# EAGLE board homeboard29 (EAGLE 6.0)
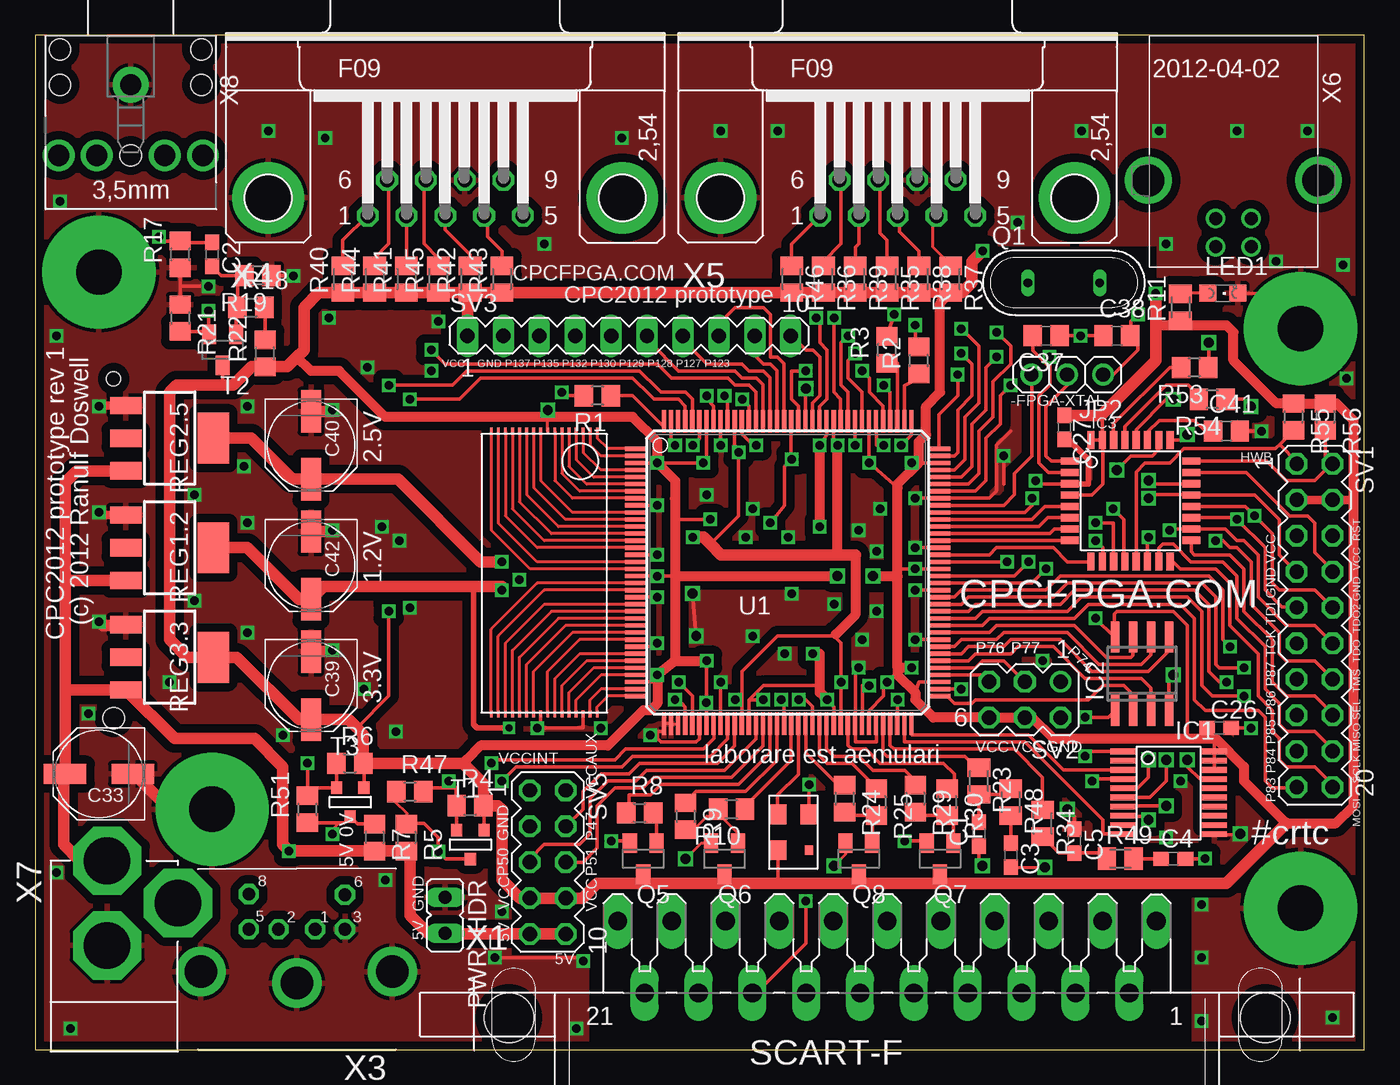
[diagram p3: board, top side]
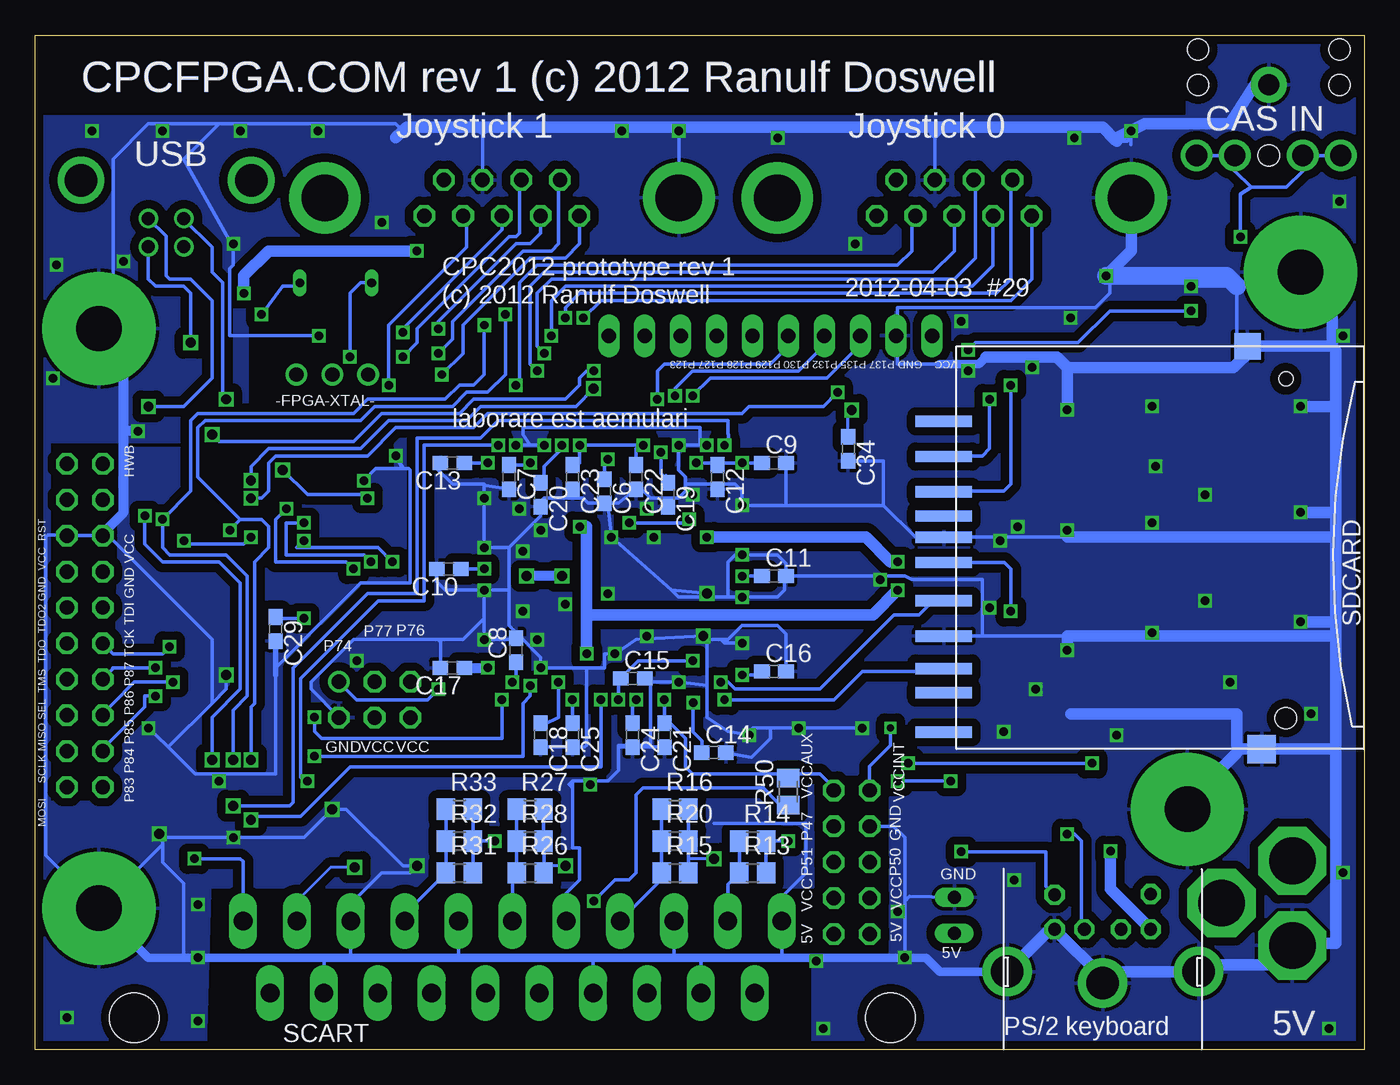
[diagram p4: board, bottom side, seen from below]

Size 94 x 71.75 mm. Coordinates in mm from the lower left corner, seen from the top.
Outline: 0,0 94,0 94,71.75 0,71.75 0,0
Copper layers (1*16): Top 0.0356mm / dielectric 1.5011mm / Bottom 0.0356mm
Design rules: minimum track width 7mil, minimum drill 15mil, track to track 7mil, track to pad 7mil, pad to pad 7mil, via to via 7mil, smd to smd 7mil, copper to edge 15mil, drill to drill 15mil, minimum pad ring 7mil, minimum via ring 7mil, stop-mask expansion 4mil, vias tented up to drill 0mil, thermal gap 10mil
Net classes: 1 power: width 0.6 mm, drill 1.1 mm, clearance 0.4 mm; 2 gnd: width 0.305 mm, drill 0.508 mm, clearance 0.152 mm

## Footprints (pad centres in the part's own frame; a part is rotated, then mirrored left to right if it is on the bottom)
C0603 = smd 1.1 x 1: 1 -0.85,0; 2 0.85,0
PANASONIC_D = smd 3 x 1.4: + 2.4,0; - -2.4,0
C0805 = smd 1.3 x 1.5: 1 -0.95,0; 2 0.95,0
VO20 = smd 0.4 x 1.8: 1 5.85,6.15; 2 5.2,6.15; 3 4.55,6.15; 4 3.9,6.15; 5 3.25,6.15; 6 2.6,6.15; 7 1.95,6.15; 8 1.3,6.15; 9 0.65,6.15; 10 0,6.15; 11 0,-0.3; 12 0.65,-0.3; 13 1.3,-0.3; 14 1.95,-0.3; 15 2.6,-0.3; 16 3.25,-0.3; 17 3.9,-0.3; 18 4.55,-0.3; 19 5.2,-0.3; 20 5.85,-0.3
SO-08 = smd 0.6 x 2.2: 1 -1.905,-2.6; 2 -0.635,-2.6; 3 0.635,-2.6; 4 1.905,-2.6; 5 1.905,2.6; 6 0.635,2.6; 7 -0.635,2.6; 8 -1.905,2.6
TQFP32-08 = smd 1.27 x 0.508: 1 -4.293,2.8; 2 -4.293,2; 3 -4.293,1.2; 4 -4.293,0.4; 5 -4.293,-0.4; 6 -4.293,-1.2; 7 -4.293,-2; 8 -4.293,-2.8; 17 4.293,-2.8; 18 4.293,-2; 19 4.293,-1.2; 20 4.293,-0.4; 21 4.293,0.4; 22 4.293,1.2; 23 4.293,2; 24 4.293,2.8 | smd 0.508 x 1.27: 9 -2.8,-4.293; 10 -2,-4.293; 11 -1.2,-4.293; 12 -0.4,-4.293; 13 0.4,-4.293; 14 1.2,-4.293; 15 2,-4.293; 16 2.8,-4.293; 25 2.8,4.293; 26 2,4.293; 27 1.2,4.293; 28 0.4,4.293; 29 -0.4,4.293; 30 -1.2,4.293; 31 -2,4.293; 32 -2.8,4.293
1X03 = drill 1.016: 1 -2.54,0; 2 0,0; 3 2.54,0
CHIPLED_0805 = smd 1.2 x 1.2: A 0,-1.05; C 0,1.05
JP1 = drill 0.914 long: 1 0,-1.27; 2 0,1.27
QS = drill 0.61 long: 1 -2.54,0; 2 2.54,0
SOT23 = smd 1 x 1.4: 1 -0.95,-1.1; 2 0.95,-1.1; 3 0,1.1
R0805 = smd 1.3 x 1.5: 1 -0.95,0; 2 0.95,0
M0805 = smd 1.3 x 1.6: 1 -0.95,0; 2 0.95,0
SOT223 = smd 1.219 x 2.235: 1 -2.311,-3.099; 2 0,-3.099; 3 2.311,-3.099 | smd 3.6 x 2.2: 4 0,3.099
MA10-2 = drill 1.016 octagon: 1 -11.43,-1.27; 2 -11.43,1.27; 3 -8.89,-1.27; 4 -8.89,1.27; 5 -6.35,-1.27; 6 -6.35,1.27; 7 -3.81,-1.27; 8 -3.81,1.27; 9 -1.27,-1.27; 10 -1.27,1.27; 11 1.27,-1.27; 12 1.27,1.27; 13 3.81,-1.27; 14 3.81,1.27; 15 6.35,-1.27; 16 6.35,1.27; 17 8.89,-1.27; 18 8.89,1.27; 19 11.43,-1.27; 20 11.43,1.27
MA03-2 = drill 1.016: 1 -2.54,-1.27 | drill 1.016 octagon: 2 -2.54,1.27; 3 0,-1.27; 4 0,1.27; 5 2.54,-1.27; 6 2.54,1.27
MA10-1 = drill 1.016 long: 1 -11.43,0; 2 -8.89,0; 3 -6.35,0; 4 -3.81,0; 5 -1.27,0; 6 1.27,0; 7 3.81,0; 8 6.35,0; 9 8.89,0; 10 11.43,0
MA05-2 = drill 1.016 octagon: 1 -5.08,-1.27; 2 -5.08,1.27; 3 -2.54,-1.27; 4 -2.54,1.27; 5 0,-1.27; 6 0,1.27; 7 2.54,-1.27; 8 2.54,1.27; 9 5.08,-1.27; 10 5.08,1.27
SOT-23 = smd 0.787 x 0.889: 1 0.025,-1.016; 2 -0.94,1.016; 3 0.991,1.016
TQ144 = smd 1.6 x 0.3: P1 -10.7,8.75; P2 -10.7,8.25; P3 -10.7,7.75; P4 -10.7,7.25; P5 -10.7,6.75; P6 -10.7,6.25; P7 -10.7,5.75; P8 -10.7,5.25; P9 -10.7,4.75; P10 -10.7,4.25; P11 -10.7,3.75; P12 -10.7,3.25; P13 -10.7,2.75; P14 -10.7,2.25; P15 -10.7,1.75; P16 -10.7,1.25; P17 -10.7,0.75; P18 -10.7,0.25; P19 -10.7,-0.25; P20 -10.7,-0.75; P21 -10.7,-1.25; P22 -10.7,-1.75; P23 -10.7,-2.25; P24 -10.7,-2.75; P25 -10.7,-3.25; P26 -10.7,-3.75; P27 -10.7,-4.25; P28 -10.7,-4.75; P29 -10.7,-5.25; P30 -10.7,-5.75; P31 -10.7,-6.25; P32 -10.7,-6.75; P33 -10.7,-7.25; P34 -10.7,-7.75; P35 -10.7,-8.25; P36 -10.7,-8.75; P73 10.7,-8.75; P74 10.7,-8.25; P75 10.7,-7.75; P76 10.7,-7.25; P77 10.7,-6.75; P78 10.7,-6.25; P79 10.7,-5.75; P80 10.7,-5.25; P81 10.7,-4.75; P82 10.7,-4.25; P83 10.7,-3.75; P84 10.7,-3.25; P85 10.7,-2.75; P86 10.7,-2.25; P87 10.7,-1.75; P88 10.7,-1.25; P89 10.7,-0.75; P90 10.7,-0.25; P91 10.7,0.25; P92 10.7,0.75; P93 10.7,1.25; P94 10.7,1.75; P95 10.7,2.25; P96 10.7,2.75; P97 10.7,3.25; P98 10.7,3.75; P99 10.7,4.25; P100 10.7,4.75; P101 10.7,5.25; P102 10.7,5.75; P103 10.7,6.25; P104 10.7,6.75; P105 10.7,7.25; P106 10.7,7.75; P107 10.7,8.25; P108 10.7,8.75 | smd 0.3 x 1.6: P37 -8.75,-10.7; P38 -8.25,-10.7; P39 -7.75,-10.7; P40 -7.25,-10.7; P41 -6.75,-10.7; P42 -6.25,-10.7; P43 -5.75,-10.7; P44 -5.25,-10.7; P45 -4.75,-10.7; P46 -4.25,-10.7; P47 -3.75,-10.7; P48 -3.25,-10.7; P49 -2.75,-10.7; P50 -2.25,-10.7; P51 -1.75,-10.7; P52 -1.25,-10.7; P53 -0.75,-10.7; P54 -0.25,-10.7; P55 0.25,-10.7; P56 0.75,-10.7; P57 1.25,-10.7; P58 1.75,-10.7; P59 2.25,-10.7; P60 2.75,-10.7; P61 3.25,-10.7; P62 3.75,-10.7; P63 4.25,-10.7; P64 4.75,-10.7; P65 5.25,-10.7; P66 5.75,-10.7; P67 6.25,-10.7; P68 6.75,-10.7; P69 7.25,-10.7; P70 7.75,-10.7; P71 8.25,-10.7; P72 8.75,-10.7; P109 8.75,10.7; P110 8.25,10.7; P111 7.75,10.7; P112 7.25,10.7; P113 6.75,10.7; P114 6.25,10.7; P115 5.75,10.7; P116 5.25,10.7; P117 4.75,10.7; P118 4.25,10.7; P119 3.75,10.7; P120 3.25,10.7; P121 2.75,10.7; P122 2.25,10.7; P123 1.75,10.7; P124 1.25,10.7; P125 0.75,10.7; P126 0.25,10.7; P127 -0.25,10.7; P128 -0.75,10.7; P129 -1.25,10.7; P130 -1.75,10.7; P131 -2.25,10.7; P132 -2.75,10.7; P133 -3.25,10.7; P134 -3.75,10.7; P135 -4.25,10.7; P136 -4.75,10.7; P137 -5.25,10.7; P138 -5.75,10.7; P139 -6.25,10.7; P140 -6.75,10.7; P141 -7.25,10.7; P142 -7.75,10.7; P143 -8.25,10.7; P144 -8.75,10.7
GNDHOLE = drill 3.2 pad 8: GND 0,0
OSC_7C = smd 0.7 x 0.6: ENA -1.27,-1.1 | smd 1.4 x 1.2: GND 1.27,-1.1; OUT 1.27,1.1; VDD -1.27,1.1
SDCARD-NOHOLE = smd 0.8 x 4 bottom: 1 7.8,0.99; 2 10.3,0.99; 3 13.5,0.99; 4 15.3,0.99; 5 18,0.99; 6 20.5,0.99; 7 22.8,0.99; 8 24.5,0.99; 9 5.3,0.99; CD 12,0.99; WP 27.3,0.99 | smd 2.032 x 2.032 bottom: MT1 28.5,-21.5 | smd 1.9 x 1.9 bottom: MT3 0,-20.5 | hole 1.5: 26.3,-23.21 | hole 1: 2.3,-23.21
TSOP32 = smd 0.5 x 0.2: P1 -9.75,3.75; P2 -9.75,3.25; P3 -9.75,2.75; P4 -9.75,2.25; P5 -9.75,1.75; P6 -9.75,1.25; P7 -9.75,0.75; P8 -9.75,0.25; P9 -9.75,-0.25; P10 -9.75,-0.75; P11 -9.75,-1.25; P12 -9.75,-1.75; P13 -9.75,-2.25; P14 -9.75,-2.75; P15 -9.75,-3.25; P16 -9.75,-3.75; P17 10.25,-3.75; P18 10.25,-3.25; P19 10.25,-2.75; P20 10.25,-2.25; P21 10.25,-1.75; P22 10.25,-1.25; P23 10.25,-0.75; P24 10.25,-0.25; P25 10.25,0.25; P26 10.25,0.75; P27 10.25,1.25; P28 10.25,1.75; P29 10.25,2.25; P30 10.25,2.75; P31 10.25,3.25; P32 10.25,3.75
SCART-CLIP = drill 1.321 long: 1 19.05,5.08; 2 17.145,0; 3 15.24,5.08; 4 13.335,0; 5 11.43,5.08; 6 9.525,0; 7 7.62,5.08; 8 5.715,0; 9 3.81,5.08; 10 1.905,0; 11 0,5.08; 12 -1.905,0; 13 -3.81,5.08; 14 -5.715,0; 15 -7.62,5.08; 16 -9.525,0; 17 -11.43,5.08; 18 -13.335,0; 19 -15.24,5.08; 20 -17.145,0; 21 -19.05,5.08 | hole 3.5: 26.75,-1.75; -26.75,-1.75
M_DIN6 = drill 0.9 pad 1.422 octagon: 1 -1.3,-3.75; 2 1.3,-3.75; 3 -3.4,-3.75; 5 3.4,-3.75; 6 -3.4,-6.2; 8 3.4,-6.25 | drill 2.3 pad 3.5: SH1 6.8,-0.75; SH2 0,0.05; SH3 -6.75,-0.75
F09HP = drill 1.016 octagon: 1 -5.486,-1.27; 2 -2.743,-1.27; 3 0,-1.27; 4 2.743,-1.27; 5 5.486,-1.27; 6 -4.115,1.27; 7 -1.372,1.27; 8 1.372,1.27; 9 4.115,1.27 | drill 3.302 pad 5.08: G1 -12.522,0; G2 12.522,0
85-32004-10X = drill 0.92 pad 1.27: 1 4.71,-1.25; 2 4.71,1.25; 3 2.71,1.25; 4 2.71,-1.25 | drill 2.3 pad 3: M1 0,6.02; M2 0,-6.02
DC-21MM = drill 3.302 pad 4.826 octagon: 1 -5.08,-3.353; 2 -0.076,-6.35; 3 -0.076,-0.356
20-0137 = drill 1.5 pad 2.54: 1 -5,0 | drill 1.5: 2 0,5.1; 3 0,2.4; 4 0,-2.4; 5 0,-5.1 | hole 1.5: -5,5; -5,-5; 0,0; -7.5,5; -7.5,-5

## Placement (x,y rotation side)
C1  100nF  [C0603]  66.75,15.25 90 top
C2  100nF  [C0603]  12.5,56.25 270 top
C3  100nF  [C0603]  69,13.75 270 top
C4  100nF  [C0603]  80.5,13.5 0 top
C5  100nF  [C0603]  73.5,14.75 270 top
C6  100nF  [C0603]  53.75,39.5 270 bottom
C7  100nF  [C0603]  60.5,40.5 270 bottom
C8  100nF  [C0603]  60,28.25 90 bottom
C9  100nF  [C0603]  41.75,41.5 0 bottom
C10  100nF  [C0603]  64.75,34 180 bottom
C11  100nF  [C0603]  41.75,33.5 0 bottom
C12  100nF  [C0603]  45.75,40.5 270 bottom
C13  100nF  [C0603]  64.5,41.5 180 bottom
C14  100nF  [C0603]  46,21 0 bottom
C15  100nF  [C0603]  51.75,26.25 0 bottom
C16  100nF  [C0603]  41.75,26.75 0 bottom
C17  100nF  [C0603]  64.5,27 180 bottom
C18  100nF  [C0603]  58.25,22.25 270 bottom
C19  100nF  [C0603]  49.25,39.25 270 bottom
C20  100nF  [C0603]  58.25,39.25 270 bottom
C21  100nF  [C0603]  49.5,22.25 270 bottom
C22  100nF  [C0603]  51.5,40.5 270 bottom
C23  100nF  [C0603]  56,40.5 270 bottom
C24  100nF  [C0603]  51.75,22.25 270 bottom
C25  100nF  [C0603]  56,22.25 270 bottom
C26  100nF  [C0603]  83.75,22.75 0 top
C27  100nF  [C0603]  72.8,44.01 270 top
C29  100nF  [C0603]  77,29.75 270 bottom
C33  100u  [PANASONIC_D]  4.5,19.5 180 top
C34  100nF  [C0603]  36.5,42.5 270 bottom
C37  20pF  [C0805]  71.5,50.5 180 top
C38  20pF  [C0805]  76.5,50.5 0 top
C39  100u  [PANASONIC_D]  19.5,25.75 270 top
C40  100u  [PANASONIC_D]  19.5,42.75 270 top
C41  1uF  [C0805]  84.25,43.75 0 top
C42  100u  [PANASONIC_D]  19.5,34.25 270 top
IC1  XCF02S  [VO20]  83.09,15.24 90 top
IC2  25LC080SN  [SO-08]  78.28,26.58 0 top
IC3  ATMEGA32U2-TQFP  [TQFP32-08]  77.47,38.82 0 top
JP2  [1X03]  73,47.75 180 top
LED1  20mA  [CHIPLED_0805]  84,53.5 270 top
PWR_HDR  [JP1]  29,9.5 180 top
Q1  [QS]  72.75,54.25 0 top
Q5  BC848SMD  [SOT23]  43,13.5 180 top
Q6  BC848SMD  [SOT23]  48.75,13.5 180 top
Q7  BC848SMD  [SOT23]  64,13.5 180 top
Q8  BC848SMD  [SOT23]  58.25,13.5 180 top
R1  100  [R0805]  39.76,46.25 180 top
R2  100  [R0805]  62.5,48.75 90 top
R3  100  [R0805]  60.25,49.5 90 top
R4  1000  [R0805]  30.75,17.25 0 top
R5  1000  [R0805]  26.25,15 270 top
R6  1000  [R0805]  22.25,20.25 0 top
R7  1000  [R0805]  24,15 270 top
R8  2200  [R0805]  42.75,16.75 0 top
R9  2200  [R0805]  46,16.5 270 top
R10  1000  [R0805]  49.25,17 180 top
R11  75  [M0805]  81,52.5 90 top
R13  680  [R0805]  43.25,12.5 0 bottom
R14  2200  [R0805]  43.25,14.75 0 bottom
R15  270  [R0805]  48.75,12.5 0 bottom
R16  680  [R0805]  48.75,17 0 bottom
R17  10000  [R0805]  10.25,56.25 90 top
R18  4700  [R0805]  15.25,52.5 0 top
R19  10000  [R0805]  15.75,54.75 180 top
R20  4700  [R0805]  48.75,14.75 0 bottom
R21  47000  [R0805]  10.25,51.75 270 top
R22  1000  [R0805]  16.25,49.25 90 top
R23  75  [M0805]  66.75,19 270 top
R24  2200  [R0805]  57.25,17.75 270 top
R25  1000  [R0805]  59.5,17.5 270 top
R26  270  [R0805]  59,12.5 0 bottom
R27  680  [R0805]  59,17 0 bottom
R28  4700  [R0805]  59,14.75 0 bottom
R29  2200  [R0805]  62.25,17.75 270 top
R30  1000  [R0805]  64.5,17.5 270 top
R31  270  [R0805]  64,12.5 0 bottom
R32  680  [R0805]  64,14.75 0 bottom
R33  4700  [R0805]  64,17 0 bottom
R34  75  [M0805]  71.25,16 270 top
R35  [M0805]  60.25,54.5 270 top
R36  [M0805]  55.75,54.5 270 top
R37  [M0805]  64.75,54.5 270 top
R38  [M0805]  62.5,54.5 270 top
R39  [M0805]  58,54.5 270 top
R40  [M0805]  21.75,54.5 90 top
R41  [M0805]  26.25,54.5 90 top
R42  [M0805]  30.75,54.5 90 top
R43  [M0805]  33,54.5 90 top
R44  [M0805]  24,54.5 90 top
R45  [M0805]  28.5,54.5 90 top
R46  [M0805]  53.5,54.5 270 top
R47  270  [R0805]  26.5,18.25 0 top
R48  2200  [M0805]  69,17.5 270 top
R49  2200  [M0805]  76.75,13.5 0 top
R50  2k2  [M0805]  40.75,18.25 90 bottom
R51  270  [R0805]  19.25,17 90 top
R53  22  [R0805]  82,48.25 180 top
R54  22  [R0805]  83.25,46 180 top
R55  4700  [R0805]  89,44.75 270 top
R56  4700  [R0805]  91.25,44.75 270 top
REG1.2  1.2V  [SOT223]  9.5,35.5 270 top
REG2.5  2.5V  [SOT223]  9.5,43.25 270 top
REG3.3  3.3V  [SOT223]  9.5,27.75 270 top
SV1  [MA10-2]  90.5,30 270 top
SV2  [MA03-2]  70,24.75 180 top
SV3  [MA10-1]  42,50.5 0 top
SV5  [MA05-2]  36.25,13.25 270 top
T1  BSS138  [SOT-23]  30.75,14.5 0 top
T2  BC848  [SOT23]  13.25,49.5 180 top
T3  BSS138  [SOT-23]  22.25,17.5 0 top
U1  XC3S400TQ144  [TQ144]  53.22,33.75 0 top
U$1  GNDHOLE  [GNDHOLE]  12.5,17 0 top
U$2  TXO_7C  [OSC_7C]  53.62,15.38 90 top
U$3  SDMMCNOHOLE  [SDCARD-NOHOLE]  28.75,49.75 270 top
U$6  AS6C4008  [TSOP32]  36,34 270 top
U$7  GNDHOLE  [GNDHOLE]  4.5,55 0 top
U$8  GNDHOLE  [GNDHOLE]  89.5,51 0 top
U$9  GNDHOLE  [GNDHOLE]  89.5,10 0 top
X1  SCART-CLIP  [SCART-CLIP]  60.25,4 0 top
X3  [M_DIN6]  18.5,4.75 180 top
X4  [F09HP]  29,60.25 0 top
X5  [F09HP]  61,60.25 0 top
X6  MINI-USB_4P-85-32004-10X  [85-32004-10X]  84.75,61.5 270 top
X7  DC21MMX  [DC-21MM]  5,7 180 top
X8  STEREOJACK  [20-0137]  6.75,63.25 270 top

## Tracks (layer width: path | path; a pad name or v marks a point on that pad's centre or on a via)
AT_CLKO  (via drill 0.7)
  Top 0.254: v78.75,40.25 79,40 81.74,40 IC3.22 | U1.P124 54.47,46.72 v54.5,46.75
  Bottom 0.254: v78.75,40.25 78.75,41.25 77.5,42.5 71,42.5 69,44.5 63.5,44.5 62.5,45.5 55.75,45.5 v54.5,46.75
AT_RESET
  Top 0.254: IC3.24 87.13,41.62 88.5,40.25 90.5,40.25 91.75,41.5 | 91.75,41.5 91.75,41.45 SV1.2 | R56.2 91.25,42 91.75,41.5
B0
  Top 0.254: U1.P63 57.47,21.53 57.75,21.25 58.75,21.25 59.75,20.25 64.25,20.25 65,19.5 65,18.7 R30.1
B1
  Top 0.254: U1.P60 55.97,21.28 56.5,20.75 58.25,20.75 59.25,19.75 61.5,19.75 62.25,19 R29.1
CASIN  (via drill 0.6)
  Top 0.254: R21.2 12.1,50.8 T2.2 12.3,50.8 12.5,51 12.25,51 v12.25,52.25 | U1.P131 50.97,46.53 50.5,47 49.5,47 49,47.5 45,47.5 44,48.5 29,48.5 v28,49.5
  Bottom 0.254: v12.25,52.25 18,52.25 20.25,50 27.5,50 v28,49.5
CLK16
  Top 0.254: U1.P56 53.97,19.47 52.5,18 52.5,16.67 U$2.OUT
CLK_5V  (via drill 0.6)
  Top 0.2: 26.3,16 26.3,16.7 25.5,17.5 25.5,18.2 R47.1
  Top 0.254: T1.1 29.02,13.48 v28.5,14 28.5,15 27.5,16 26.3,16 R5.1
  Bottom 0.254: v28.5,14 22.5,14 22.5,11.55 X3.6
CSYNC
  Top 0.254: U1.P52 51.97,20.97 49.75,18.75 44.25,18.75 43.5,18 42,18 42,16.95 R8.1
DATA_5V  (via drill 0.6)
  Top 0.2: v21,15.25 21,15.55 21.5,16.05
  Top 0.254: R7.1 22.81,15.95 T3.1 21.84,16.05 21.5,16.05 R51.1
  Bottom 0.254: v21,15.25 20.5,15.25 20,14.75 20,8.7 X3.1
EMER_BOOT
  Top 0.254: SV1.1 89.23,41.57 88.05,42.75 88.05,42.85 | 88.05,42.85 R55.2 | IC3.13 77.87,40.87 78.5,41.5 80.25,41.5 81.25,42.5 87.7,42.5 88.05,42.85
EXP_A
  Top 0.254: U1.P47 49.47,21.47 48.25,20.25 42.75,20.25 42,19.5 40,19.5 38.75,18.25 38.75,17 37.52,15.77 SV5.4
EXP_B
  Top 0.254: U1.P50 50.97,21.97 48.75,19.75 43.25,19.75 42.5,19 40.5,19 39.25,17.75 39.25,15.25 38.5,14.5 36,14.5 34.98,13.48 SV5.5
EXP_C
  Top 0.254: U1.P51 51.47,21.47 49.25,19.25 43.75,19.25 43,18.5 41,18.5 39.75,17.25 39.75,14.25 38.75,13.25 SV5.6
EXTCLK
  Top 0.254: U1.P100 68.5,38.5 69.25,39.25 69.25,40.75 70.5,42 70.5,47.75 JP2.3
FL_DI
  Top 0.254: U1.P79 65.5,28 66,28.5 68.5,28.5 69,29 72.5,29 74.75,26.75 78.75,26.75 80.19,28.18 IC2.5
FL_DO
  Top 0.254: IC2.2 77.64,25.11 77,25.75 75.5,25.75 74.5,24.75 66.5,24.75 66.25,24.5 65,24.5 64.5,25 U1.P73
FL_HOLD
  Top 0.254: U1.P82 67.5,29.5 68,30 73.5,30 75.75,27.75 77.5,27.75 77.64,27.89 IC2.7
FL_SCLK
  Top 0.254: U1.P80 65,28.5 65.5,29 68,29 68.5,29.5 73,29.5 75.25,27.25 78.25,27.25 78.92,27.91 IC2.6
FL_SEL  (via drill 0.6)
  Top 0.254: v74.25,23.5 75.89,23.5 IC2.1 | v61,24.75 61,23.08 U1.P70
  Bottom 0.254: v74.25,23.5 74.25,22.5 73.75,22 61,22 v61,24.75
FL_WP
  Top 0.254: U1.P78 66,27.5 66.5,28 69,28 69.5,28.5 72,28.5 74.25,26.25 78.25,26.25 78.92,25.59 IC2.3
FPGA_AUDIO_LEFT
  Top 0.254: U1.P68 59.97,21.03 60.25,20.75 65.75,20.75 66.55,19.95 R23.1
FPGA_AUDIO_RIGHT
  Top 0.254: U1.P69 60.47,21.53 60.75,21.25 69.25,21.25 71.25,19.25 R34.1
G0
  Top 0.254: U1.P59 55.47,20.78 56,20.25 57.75,20.25 59,19 R25.1
G1
  Top 0.254: U1.P57 54.5,23.02 54.5,21 56.75,18.75 R24.1
GND  (via drill 0.6, 0.7)
  Top 0.2: U1.P37 U1.P38 U1.P39 | IC1.11 85.24,15.24 v85.25,15.25 | LED1.C 87,53.5 U$8.GND
  Top 0.254: U1.P9 v44,38.5 | U1.P22 v44,32 | U1.P16 v44,35 | U1.P81 v62.25,29 | U1.P88 v62.25,32.5 | U1.P94 v62.25,35.5 | U1.P117 57.97,43.03 v58,42.75 | v60,42.75 59.5,42.75 59.5,44.5 59.47,44.47 U1.P114 | U$6.P30 38.75,22.75 35.75,22.75 | U$6.P24 35.75,22.75 | 35.75,22.75 v35.5,22.75 | 44,22.5 v43.5,22.25 | U1.P29 43.75,28.5 v44,28.75 | U1.P42 46.97,21.97 46.75,21.75 44.25,21.75 44,22 44,22.5 | U1.P67 59.5,23.05 59.5,21.75 58,21.75 58,23.08 | v58.25,27 58,27 58,23.08 | 58,23.08 U1.P64 | R17.1 10.25,55.25 | R21.1 10.25,54 | 10.25,54 10.25,55.25 | 10.25,55.25 10,55.5 | R19.1 v18.25,54.75 | v12.25,54 10.25,54 | v62.25,39 U1.P101 67.5,39 68,39.5 68,42.75 69,43.75 | C38.1 v73.95,50.5 C37.1 | v70.75,40.25 71,40 73.15,40 IC3.3 73.23,40.02 73.25,40 | U1.P37 44.47,23.03 44.5,23 44.5,22.5 44,22.5 | U1.P39 45.47,23.03 45.5,23 | 68.5,40 v68.5,42 | U1.P45 48.47,25.72 v48.5,26 | U1.P136 48.47,43.03 v48.5,42.75 | 7,19.5 C33.- | 46.97,44.47 U1.P139 46.97,43.22 v46.5,42.75 | U$2.GND 54.73,18.73 v54.75,18.75 | v46.75,29.25 v46.5,32.25 | C5.1 73.5,16.5 v73,17 | IC2.4 80.19,26.18 v80.5,26.5 | C26.2 v86,22.75 | C1.1 66.75,13.25 v67,13 | v86.75,43.75 85.25,43.75 | 85.25,43.75 85,44 | C41.2 85.25,43.75 | v32.5,6.5 38.5,6.5 v38.75,6.25
  Top 0.406: C27.2 73.09,43.16 74.5,41.75 74.5,40 73.25,40
  Top 0.6: 6,30 6.4,30 REG3.3.1
  Top 0.61: REG2.5.1 4.56,45.56 v4.5,45.5 | REG1.2.1 4.69,37.81 v4.5,38
  Top 0.8: C39.- 20.5,28.15 v21,28.25 | C42.- 21,36.65 v21,36.75 | C40.- 21,45.15 v21,45.25 | U$1.GND 9.5,17 7,19.5
  Top 0.813: 6,30 4.75,30 v4.5,30.25
  Bottom 0.2: 25.5,5.5 X3.SH3 | 22.25,8.5 X3.3 | 18.5,5.1 X3.SH2 | v85.25,15.25 85,15 | 85,13.25 85,13.5
  Bottom 0.254: v62.25,32.5 62.15,32.4 | 62.25,30.5 v62.25,29 60.1,29 C8.2 | 62.25,30.5 v62.25,32.5 | 47,42.75 v48.5,42.75 48.5,41 48,40.5 48,40.1 | 47,42.75 v46.5,42.75 | 56,39 55.25,39 54.9,38.65 C6.2 | v58,42.75 59,42.75 | 59,42.75 v60,42.75 | 34,38.5 34,41.65 C34.2 | 47,42.75 47,44 59.5,44 59.5,43.5 59,42.75 | 60.5,32.5 v62.25,32.5 | v44,32 45,32 45,34.5 44.5,35 v44,35 41.5,35 40.9,34.4 C11.2 32.5,33.5 32,33.25 27,33.25 27,29.25 | 60.5,35.5 v62.25,35.5 v62.25,39 62.25,40 | v35.5,22.75 42,22.75 | 42,22.75 43.25,22.75 v43.5,22.25 45,22.5 46.5,23.5 46.5,25.75 | U$3.6 27,29.25 | 27,29.25 21,29.25 | 21,36.25 U$3.3 31.75,36.25 34,38.5 | v44,28.75 45.25,28.75 45.5,29 | 56,19 56,14.25 55.5,14.25 55.5,12 56.5,11 56.44,10.94 X1.13 | v12.25,54 9,54 9,50.5 U$3.MT3 | 81,65.5 83.5,63 80,56.75 80,55.5 80.25,55.25 80.25,50.5 v73.95,50.5 | 81,65.5 68.5,65.5 68,65 | 85,14.5 85,15 75,15 v73,17 72,17 68,13 v67,13 67.5,12.5 69.5,12.5 71.68,10.32 X1.5 71.68,6.82 | 85,14.5 85,13.25 83.5,11.75 83.5,6.5 | 30,48.5 33,48.5 33,50.5 SV3.2 33,50.61 33,52.5 19,52.5 18,53.5 18,54.5 v18.25,54.75 | X5.G1 48.48,65.23 | X4.8 30.37,64.62 31,65.25 | X5.8 62.37,65.12 | 81,65.5 86,65.5 88.5,63 88.5,50.5 U$8.GND | 77,26.5 77,19.5 82.7,19.5 84.6,21.4 | SV2.2 72.54,23.54 74.5,25.5 74.5,26 71.5,29 65.5,29 | 65.5,29 63.75,29 62.25,30.5 | v70.75,40.25 69.91,41.09 68,41.09 | 68,41.09 67.59,41.09 67.5,41 67.5,33 71,33 77,27 | v68.5,42 68,41.09 | 52.4,21.4 C24.2 C21.2 52.65,21.4 52.75,21.5 | 55,27 55,21.5 55.15,21.4 C25.2 C18.2 | 52.75,21.5 52.75,19.75 53.5,19 54.75,19 | 52.75,21.5 50.5,21.5 50.5,26 | C16.2 40.9,29.4 41.5,30 44,30 45,29 45.5,29 | C10.2 65.6,33.1 65,32.5 v62.25,32.5
  Bottom 0.254: C17.2 65.35,28.85 65.5,29 | 62.25,40 64.5,40 65.6,41.1 65.6,41.4 65.5,41.5 C13.2 | C14.2 43.35,20.65 42,22 42,22.75 | 46.5,29 v46.75,29.25 51.5,29 v53,28 53.75,28 53.75,27 55,27 | 46.5,29 45.5,29 | C15.2 50.5,26 | 50.5,26 v48.5,26 46.5,25.75 | 46.5,25.75 46.5,29 | 41,33.5 41,32.5 41.5,32 48.5,32 49,32.5 | C9.2 40.9,38.6 41,38.5 | 41,38.5 v44,38.5 44,39.5 44.5,40 45.65,40 C12.2 46.1,40 47.9,40 48,40.1 | 34,38.5 41,38.5 | 55,27 v58.25,27 58.25,27.75 59.5,29 60,29 | C7.2 62.15,39.9 62.25,40 | C23.2 56,39 | 48,40.1 48,39.5 48.5,39 49.5,39 | 9,21 9,21.25 | 17.5,64.5 17.62,64.38 | SV5.3 33.29,15.79 32.5,15 32.5,10.5 | 32.5,10.5 v32.5,6.5 | PWR_HDR.1 32.18,10.82 32.5,10.5 | 84.6,21.4 81.5,24.5 | 81.5,24.5 80.5,25.5 v80.5,26.5 | v86,22.75 84.7,21.5 84.6,21.4 | C19.2 49.4,38.9 49.5,39 | v54.75,18.75 54.75,19 | 17.5,64.25 16.75,64.25 16.5,64.5 16.5,64 | 60.5,35.5 60.5,32.5 | 60.5,32.5 60.5,30 60,29.5 | 49.5,39 50.5,39 51.5,40 C22.2 52.75,38.65 C6.2 | C20.2 58.25,37.75 60.5,35.5 | 56,39 58,39 58.5,38.5 58,38.5 | 49,32.5 v53.25,36.25 53.5,38.4 C6.2 | v46.5,32.25 49,32.5 | 85,14.5 U$9.GND 93.25,13.75 93.25,36.25 93.11,36.39 91.81,36.39 SV1.6 SV1.5 | 41,6.5 41.2,6.7 X1.21 41.2,10.8 39.5,12.5 39.5,16 46,16 | X1.18 46.91,6.42 47,6.5 | X1.17 48.82,6.68 49,6.5 | X1.14 54.53,6.46 54.5,6.5 | X1.9 64.06,6.56 64,6.5 | X1.4 73.58,6.42 73.5,6.5 | 81.5,24.5 81.5,29 89,36.5 | 89.25,36.5 89.25,36.25 | 54.75,19 56,19 | 56,19 56.25,18.75 56,18.5
  Bottom 0.406: 77,26.5 77,27 C29.2
  Bottom 0.6: 4.93,7.5 X7.3 | 25.5,5.5 30,5.5 31,6.5 v32.5,6.5 41,6.5 47,6.5 49,6.5 54.5,6.5 64,6.5 73.5,6.5 83.5,6.5 86,6.5 U$9.GND | 26.75,49 27.25,48.5 30,48.5
  Bottom 0.61: 2,36 2,36.25
  Bottom 0.7: 89.25,36.5 87.75,38 87.75,43.75 | 87.75,43.75 87.75,48.75 U$8.GND | v86.75,43.75 87.75,43.75
  Bottom 0.8: 2,30 2,36 2,38 | X3.SH3 22.25,8.5 | X3.3 18.5,5.1 | X3.SH2 17.7,5.5 X3.SH1 11.2,6 6.43,6 X7.3 | 30.37,64.88 30,65.25 | 30,65.25 18.5,65.25 17.62,64.38 17.5,64.25 | 2,29.25 21,29.25 v21,28.25 | 2,36.25 21,36.25 v21,36.75 | v21,45.25 21,48.25 | 7.5,21.5 7.5,21.25 9,21.25 9,23.75 20.75,23.75 | U$1.GND 12.5,17.5 9,21 | 2,45.5 2,49.5 2.25,49.75 | 2,45.5 2,38 | v4.5,45.5 2,45.5 | v4.5,38 2,38 | 2.5,30.25 2.25,30.25 2,30 | 2,30 2,29.25 | U$3.MT1 2,21.25 | 2,21.25 2,29.25 | 4.93,7.5 2,7.5 2,21.25 | U$3.MT3 2.25,49.75 | 2.25,49.75 2.25,51.75 U$7.GND | 21,48.25 9.25,48.25 8,49.5 | 26.75,49 21.75,49 21,48.25 | X4.G1 16.48,56.52 v18.25,54.75 | X8.1 7.75,68.25 9.5,65.5 15.5,65.5 17.5,64.5 | 30,65.25 31,65.25 48.5,65.25 | 48.5,65.25 62.5,65.25 | 62.5,65.25 67.75,65.25 68,65 68.5,64.5 | 62.37,65.12 62.5,65.25 | 48.48,65.23 48.5,65.25
  Bottom 0.813: U$3.MT1 9,21.25 | v4.5,30.25 2.5,30.25
  Bottom 1.27: v18.25,54.75 9.75,54.75 9,54
  other vias: 15,37.25 85,65 82.5,2 26.5,31.25 2.5,1.5 59.5,35.25 59.5,31 71.25,27.5 41.5,64.5 74,65 15,29.5 15,45.5 9.5,26 23.5,48.25 47.5,39.25 56.5,31.5 34.25,33.25 25.5,22.5 81,19 20.5,64.5 52.5,65 24.5,37 87.75,55.75 69.5,58.5 80,57 36,57 20.75,51.75 92.75,47.5 59.75,38.25 53.5,32.25 50.75,29.25 92.5,55.5 90,65 79.5,65 48.5,65 16.5,65 38.25,1.5 1.5,12.5 91.75,2.25 1.75,60 82.5,6.5 50.75,38.25 80,15 82.5,10.25 40,22.75 3.75,23.75 28,48 50.25,36.25 28.5,51.5 14.75,41.25 11.25,39.25 11.25,31.75 17.5,22.25 23.25,25.5 25.75,36 1.5,50.5 24.75,12 33,9.75 58.25,36.75 58.5,29
  pour Bottom (isolate 0.6): 0,72 12.5,72 12.5,66 94,66 94,15.5 93,15.5 93,43 79,43 79,56.5 66,56.5 66,50.5 68.5,50.5 68.5,41 70,41 71,40 76,40 76,42.5 88,42.5 88.5,11.5 56,11.5 56,19 54.5,19 54.5,25.5 53.5,25.5 53.5,19 51.5,19 51.5,11.5 39,11.5 39,19.5 0,19.5
  pour Bottom (isolate 0.6): -0.5,-0.5 -0.5,22.5 33.5,22.5 33.5,6.5 39,6.5 39,0 82,0 81.5,17.5 94.5,17.5 94.5,0
  pour Top (isolate 0.6): 0,72 94.5,72 94.5,43 79.5,43 79.5,57 66.5,57 66.5,45.5 70,45.5 70,41 55.5,41 55.5,52.5 28.5,52.5 28.5,48 53.5,48 53.5,44 -0.5,44 -0.5,72
  pour Top (isolate 0.6): -0.5,0.5 -0.5,48.5 69,48.5 69,39.5 74.5,39.5 74.5,45 88,45 88,25.5 85,25.5 85,20 85.5,20 85.5,19 88,19 88,14.5 67.5,14.5 67.5,22 81,22 81,27.5 66,27.5 66,12 56.5,12 56.5,18.5 54.5,18.5 54.5,24.5 51,24.5 51,12 39,12 39,19.5 33.5,19.5 33.5,6.5 39,6.5 39,0.5
  pour Top (isolate 0.6): 94.5,0 94.5,17 82,17 82,0
HDR_MISO  (via drill 0.6)
  Top 0.254: v84.25,26 83.75,26 83,26.75 83,31.5 82,32.5 73.5,32.5 72.5,31.5 66.5,31.5 66,31 U1.P85
  Bottom 0.254: v84.25,26 87,26 88.5,24.5 88.97,24 89.23,23.74 SV1.15
HDR_MOSI
  Top 0.254: 89.07,18.57 89.25,18.75 | U1.P83 67,30 67.5,30.5 73.5,30.5 74.5,31.5 81,31.5 82,30.5 82,24.75 82.75,24 86.5,24 87,23.5 87,19 87.5,18.5 89,18.5 89.07,18.57 | SV1.19 89.07,18.57
HDR_SCLK  (via drill 0.6)
  Top 0.254: v85.5,25 83.25,25 82.5,25.75 82.5,31 81.5,32 74,32 73,31 67,31 66.5,30.5 U1.P84
  Bottom 0.254: v85.5,25 86.25,25 86.25,24.25 89.23,21.27 SV1.17
HDR_SEL  (via drill 0.6)
  Top 0.254: v85.5,27 83.75,27 83.5,27.25 83.5,32 82.5,33 73,33 72,32 66,32 65.5,31.5 U1.P86
  Bottom 0.254: v85.5,27 88.51,27 88.51,26.91 SV1.13
HDR_SPARE  (via drill 0.6)
  Top 0.254: v84.5,28.5 84,29 84,32.5 83,33.5 72.5,33.5 71.5,32.5 65.5,32.5 65,32 U1.P87
  Bottom 0.254: v84.5,28.5 85,28 88.5,28 SV1.11 89.25,28.75
JOY0_DOWN  (via drill 0.6)
  Top 0.254: U1.P118 57.47,46.53 57,47 57,50 v57.5,50.5 | R41.2 X4.2
  Bottom 0.254: v57.5,50.5 57.5,53 56.5,54 27.7,54 R41.2 X4.2
JOY0_FIRE1  (via drill 0.6)
  Top 0.254: U1.P116 58.47,46.53 57.5,47.5 57.5,48.75 v58,49.25 | R45.2 28.5,56 27.5,57 27.5,61.39 X4.7
  Bottom 0.254: v58,49.25 58.5,49.75 58.5,53.5 57.5,54.5 29,54.5 27.5,56 27.5,61.39 X4.7
JOY0_FIRE2  (via drill 0.6)
  Top 0.254: U1.P119 56.97,46.03 56.5,46.5 v56.5,51.75 | R44.2 24,56 25,57 25,61.41 X4.6
  Bottom 0.254: v56.5,51.75 56.5,52.5 55.5,53.5 26,53.5 25,54.5 25,61.41 X4.6
JOY0_LEFT  (via drill 0.6)
  Top 0.254: U1.P113 59.97,45.53 59,46.5 59,47.5 v58.5,48 | R42.2 30.75,56.25 29,58 X4.3
  Bottom 0.254: v58.5,48 59,48.5 59,54 58,55 30.5,55 29,56.5 X4.3
JOY0_RIGHT  (via drill 0.6)
  Top 0.254: U1.P112 60.47,46.53 v60,47 | R43.2 33,56.5 32,57.5 32,58.72 X4.4
  Bottom 0.254: v60,47 59.75,47 59.75,54.25 58.5,55.5 33,55.5 32,56.5 32,58.72 X4.4
JOY0_UP  (via drill 0.6)
  Top 0.254: U1.P122 55.47,45.47 56,46 56,49.5 55.5,50 55.5,51.5 v55.25,51.75 | R40.2 21.75,57.25 23.5,59 X4.1
  Bottom 0.254: v55.25,51.75 54,53 25,53 23.5,54.5 23.5,58.97 X4.1
JOY1_DOWN  (via drill 0.6)
  Top 0.254: U1.P105 65,41 65.75,41.75 65.75,44.75 66.75,45.75 66.75,49.75 v65.5,51 | R39.1 58,56.75 58.25,57 X5.2
  Bottom 0.254: X5.2 58.26,57.76 59.01,57 60,57 65.5,51.5 v65.5,51
JOY1_FIRE1  (via drill 0.6)
  Top 0.254: U1.P104 65.5,40.5 66.25,41.25 66.25,44.25 67.25,45.25 67.25,48.25 v68,49 | R35.1 60.25,57.25 59.75,57.75 59.75,61.4 X5.7
  Bottom 0.254: X5.7 59.75,61.4 59.75,57.75 60,57.5 60.5,57.5 67,51 67,50 v68,49
JOY1_FIRE2  (via drill 0.6)
  Top 0.254: R36.1 55.75,55.75 57,57 57,61.41 X5.6 | U1.P107 65,42 65.25,42.25 65.25,45.25 66.25,46.25 66.25,48.5 v65.5,49.25
  Bottom 0.254: X5.6 57,61.41 57,57 57.5,56.5 59.5,56.5 64.5,51.5 64.5,50.25 v65.5,49.25
JOY1_LEFT  (via drill 0.6)
  Top 0.254: U1.P103 66,40 66.75,40.75 66.75,43.75 67.75,44.75 67.75,47.25 69,48.5 69,49.75 v68,50.75 | R38.1 62.5,56.5 61.12,57.88 61.12,58.85 X5.3
  Bottom 0.254: 61,59 X5.3 61,58 68,51 v68,50.75
JOY1_RIGHT  (via drill 0.6)
  Top 0.2: R37.1 64.75,55.5 63.5,56.75 63.5,58.74 X5.4
  Top 0.254: U1.P102 66.5,39.5 67.25,40.25 67.25,43.25 68.25,44.25 68.25,46.25 v69,47
  Bottom 0.254: X5.4 63.5,58.74 63.5,56.75 69,51.25 v69,47
JOY1_UP  (via drill 0.6)
  Top 0.254: 55.5,59 X5.1 53.5,56.97 R46.1 | U1.P108 63.92,44.92 65.25,46.25 v65.25,47.75
  Bottom 0.254: X5.1 55.5,58.97 55.5,57 56.5,56 59,56 63.75,51.25 63.75,49.25 v65.25,47.75
N$1  (via drill 0.6)
  Top 0.254: U1.P135 48.97,46.03 v48.75,46.25
  Bottom 0.254: v48.75,46.25 48.75,46.75 47.5,48 40,48 38.25,49.75 38.25,50.44 SV3.4
N$2  (via drill 0.6)
  Top 0.254: U1.P132 50.47,45.53 v50,46
  Bottom 0.254: v50,46 50,48 49.5,48.5 42,48.5 41,49.5 41,50.25 40.75,50.5 SV3.5
N$3  (via drill 0.6)
  Top 0.254: U1.P137 47.97,45.53 47.5,46 v47.5,46.25
  Bottom 0.254: v47.5,46.25 46.25,47.5 38,47.5 35.5,50 35.5,50.35 SV3.3
N$4
  Top 0.254: U1.P130 51.47,47.03 51,47.5 50,47.5 49.5,48 45.5,48 43.5,50 43.5,50.27 SV3.6
N$5
  Top 0.254: U1.P129 51.97,47.53 51.5,48 50.5,48 50,48.5 47.5,48.5 46,50 46,50.25 45.75,50.5 SV3.7
N$6
  Top 0.254: U1.P128 52.47,48.03 52,48.5 51.5,48.5 51,49 51,50.5 SV3.9
N$7
  Top 0.254: U1.P127 52.97,48.53 52.5,49 52,49 52,52 51.5,52.5 49.5,52.5 48.5,51.5 48.5,50.65 SV3.8
N$8
  Top 0.254: 72.88,41.62 IC3.1 71.88,41.62 71.5,42 71.5,45.5 73,47 JP2.2
N$9
  Top 0.254: IC3.27 78.67,43.67 79.5,44.5 82,44.5 82.75,43.75 C41.1
N$10
  Top 0.2: LED1.A 81,53.5 R11.2
N$12  (via drill 0.6)
  Top 0.254: v71.75,49 71.75,48.25 | C37.2 70.55,49.45 71.75,48.25 | IC3.2 71.68,40.82 71,41.5 71,46.25 71.75,47 71.75,48.25
  Bottom 0.254: Q1.1 71,54.25 71.75,53.5 v71.75,49
N$14  (via drill 0.6)
  Top 0.254: v78,52 77.5,51.55 C38.2 78,50.45 78,49.5 76.25,47.75 JP2.1
  Bottom 0.254: Q1.2 75.54,54 76.5,54 v78,52
N$16
  Top 0.254: U1.P123 54.97,45.72 55.5,46.25 55.5,49 55,49.5 54.5,49.5 53.5,50.5 SV3.10
N$35
  Top 0.254: U1.P72 61.97,23.03 62,23 62,22.25 70.25,22.25 72.71,19.79 IC1.3
N$36  (via drill 0.7)
  Top 0.254: R53.1 83,48.3 v83,50
  Bottom 0.254: X6.2 86,54.5 85.5,54 83.5,54 83,53.5 v83,50
N$38
  Top 0.254: U1.P71 61.47,21.78 61.5,21.75 70,21.75 75.5,16.25 75.5,15.25 76.75,15.25 76.76,15.24 IC1.10
N$39
  Top 0.254: U1.P110 61.47,46.97 62.5,47.5 R2.1
N$40  (via drill 0.6, 0.7)
  Top 0.254: IC1.7 77,17.25 77,17.24 IC1.7 77.01,17.25 v80,17.25 | U1.P143 44.97,42.97 v45.25,42.75
  Bottom 0.254: v45.25,42.75 44.97,43.03 44.97,43.5 45,43.53 45,44.5 61.25,44.5 62.5,43.25 67,43.25 67,32.25 70.5,32.25 75.75,27 75.75,17.5 76,17.25 v80,17.25
N$42
  Top 0.254: U1.P144 44.47,44.03 42.25,46.25 40.75,46.25 40.71,46.21 | R1.1 40.71,46.21 | 40.71,46.21 40.5,46
N$43
  Top 0.254: U1.P111 60.97,48.58 R3.1
N$49
  Top 0.254: IC3.29 77.07,44.07 80,47 81.55,47 82.3,46.25 R54.2
N$50
  Top 0.254: REG2.5.2 6.65,43.5
N$51
  Top 0.254: C1.2 R23.2 68.6,18.05 R48.1
N$52
  Top 0.254: C3.1 R48.2
N$53
  Top 0.2: 46.3,15.55 46.55,15.55 47.5,16.5 47.8,16.5 R10.2 | 49.7,15.05 49.7,15.3 48.5,16.5 48.5,16.8
  Top 0.254: R9.2 46.3,15.55 | Q6.1 49.7,15.05 | 48.5,16.8 R10.2
N$54  (via drill 0.7)
  Top 0.2: Q6.2 47.1,14.6 v46,13.5
  Top 0.254: Q6.2 47.6,14.6
  Bottom 0.2: v46,13.5 47.8,13.5
  Bottom 0.254: R16.2 R20.2 47.8,13.5 R15.2
N$55
  Top 0.254: R24.2 57,16.55 R25.2 59.2,16.35 Q8.1
N$56  (via drill 0.7)
  Top 0.2: Q8.2 57.3,13.8 v56.5,13
  Top 0.254: Q8.2 57.05,14.05
  Bottom 0.2: v56.5,13 58,13
  Bottom 0.254: R27.2 R28.2 58.05,14.95 58,15 58,13 58,12.55 R26.2
N$57
  Top 0.254: Q7.1 64.95,16.25 R30.2 62.95,16.55 62.5,17 62.45,17 R29.2
N$58  (via drill 0.6)
  Top 0.254: v61.5,14.75 62.9,14.75 Q7.2
  Bottom 0.254: R31.2 R32.2 | R32.2 R33.2 | R32.2 v61.5,14.75
N$59  (via drill 0.6)
  Top 0.254: v40.75,14.75 41.65,14.75 Q5.2
  Bottom 0.254: R13.2 R14.2 v40.75,14.75
N$60
  Top 0.254: C2.2 13.15,54.75 R19.2 14.3,54.25 R18.1 14.2,52.4 T2.1
N$61  (via drill 0.6)
  Top 0.254: C2.1 9.85,57.1 R17.2 9.05,57.2 v8.75,57.5
  Bottom 0.254: 12,63.1 X8.2 X8.3 9.15,62.15 8,61 | X8.5 X8.4 4.35,62.15 5.5,61 8,61 | v8.75,57.5 8.75,60.5 8,61
N$62
  Top 0.254: R22.2 16.25,52.25 | 16.25,52.25 16.5,52.5 | R18.2 16.2,52.3 16.25,52.25
N$63
  Top 0.254: Q5.1 43.95,16.5 R8.2
N$64
  Top 0.254: C4.1 R49.2
N$65
  Top 0.254: R34.2 72.4,13.9 C5.2 75.4,13.9 R49.1
N$66  (via drill 0.7)
  Top 0.254: R54.1 85.5,46 v86,45.5
  Bottom 0.254: X6.3 84.75,57.54 84.75,54.75 84.5,54.5 83,54.5 81.5,53 81.5,47.5 83.5,45.5 v86,45.5
N$67
  Top 0.2: U$6.P1 39.75,43.25 40.5,42.5 U1.P1
N$68
  Top 0.254: IC3.30 76.27,44.27 80.25,48.25 R53.2
N$69  (via drill 0.7)
  Top 0.254: IC3.28 77.87,43.87 80,46 v80.5,46
  Bottom 0.254: v80.5,46 80.5,46.25 80.75,46.5 80.75,54.25 81.5,55 81.5,56.75 83.5,58.75 X6.4
N$71
  Top 0.2: U$6.P2 39.25,42.75 40,42 U1.P2
N$72
  Top 0.2: U$6.P3 38.75,42.25 40,41 U1.P4
N$73
  Top 0.2: U$6.P4 38.25,41.75 39.5,40.5 U1.P5
N$74
  Top 0.2: U$6.P5 37.75,41.25 39,40 U1.P6
N$75
  Top 0.2: U$6.P6 37.25,40.75 38.5,39.5 U1.P7
N$76
  Top 0.2: U$6.P7 36.75,40.25 38,39 U1.P8
N$77
  Top 0.2: U$6.P9 35.75,40.25 38,38 U1.P10
N$78
  Top 0.2: U$6.P10 35.25,39.75 37.5,37.5 U1.P11
N$79
  Top 0.2: U$6.P11 34.75,39.25 37,37 U1.P12
N$80
  Top 0.2: U$6.P12 34.25,38.75 36.5,36.5 U1.P13
N$81
  Top 0.2: U$6.P13 33.75,38.25 36,36 U1.P14
N$82
  Top 0.2: U$6.P14 33.25,37.75 35.5,35.5 U1.P15
N$83
  Top 0.2: U$6.P15 32.75,37.25 35.5,34.5 U1.P17
N$84
  Top 0.2: U$6.P16 32.25,36.75 35,34 U1.P18
N$85
  Top 0.2: U$6.P17 32.25,29.75 35.5,33 U1.P20
N$86
  Top 0.2: U$6.P18 32.75,29.25 36,32.5 U1.P21
N$87
  Top 0.2: U$6.P19 33.25,28.75 36,31.5 U1.P23
N$88
  Top 0.2: U$6.P20 33.75,28.25 36.5,31 U1.P24
N$89
  Top 0.2: U$6.P21 34.25,27.75 37,30.5 U1.P25
N$90
  Top 0.2: U$6.P22 34.75,27.25 37.5,30 U1.P26
N$91
  Top 0.2: U$6.P23 35.25,26.75 38,29.5 U1.P27
N$92
  Top 0.2: U$6.P25 36.25,26.75 38.5,29 U1.P28
N$93
  Top 0.2: U$6.P26 36.75,26.25 38.5,28 U1.P30
N$94
  Top 0.2: U$6.P27 37.25,25.75 39,27.5 U1.P31
N$95
  Top 0.2: U$6.P28 37.75,25.25 39.5,27 U1.P32
N$96
  Top 0.2: U$6.P29 38.25,24.75 40,26.5 U1.P33
N$97
  Top 0.2: U$6.P31 39.25,24.75 40,25.5 U1.P35
N$98
  Top 0.2: U$6.P32 39.75,24.25 40.5,25 U1.P36
PC2
  Top 0.254: U1.P98 70.5,37.5 71.42,38.42 IC3.5
PC4  (via drill 0.6, 0.7)
  Top 0.254: U1.P99 70,38 70.5,38.5 v70.5,39 | IC3.26 79.47,42.47 79,42 77.5,42 v76.5,41
  Bottom 0.254: v70.5,39 70.5,39.25 74.75,39.25 v76.5,41
PC5  (via drill 0.6, 0.7)
  Top 0.254: U1.P125 53.97,45.53 53.5,46 53.5,48 v54.5,48 | IC3.25 81.12,43.12 v81.5,43.5
  Bottom 0.254: v54.5,48 55,48 55.5,47.5 55.5,47 56.5,46 63,46 64,45 69.5,45 71.5,43 81,43 v81.5,43.5
PD0
  Top 0.254: U1.P97 71,37 71.62,37.62 IC3.6
PD1
  Top 0.254: U1.P96 71.75,36.5 72.07,36.82 IC3.7
PD2
  Top 0.254: U1.P95 73.15,36 IC3.8
PD3
  Top 0.254: U1.P93 67.5,35 68,35.5 72,35.5 73,34.5 74.64,34.5 IC3.9
PD4  (via drill 0.6)
  Top 0.254: v75,36 75.5,35.5 75.5,34.56 IC3.10 | U1.P92 v68.75,34.5
  Bottom 0.254: v75,36 75.5,35.5 69.75,35.5 v68.75,34.5
PD5  (via drill 0.6)
  Top 0.254: 76.25,34.76 IC3.11 76.25,34.51 | v75,37.25 76.25,37.25 76.25,34.51 | U1.P90 69.25,33.5 v70.25,34.5 | 76.25,34.5 76.25,34.51
  Bottom 0.254: v75,37.25 76.25,37.25 76.25,35 70.75,35 v70.25,34.5
PD6  (via drill 0.6)
  Top 0.254: v76.25,38.25 77,37.5 77,34.6 IC3.12 | U1.P89 70.5,33 v71.5,34
  Bottom 0.254: v76.25,38.25 77,37.5 77,34.5 72,34.5 v71.5,34
PROM_DO  (via drill 0.6)
  Top 0.254: U1.P65 58.5,22.52 58.5,25.75 v59,25.75 | IC1.1 74.59,21.09 v74.25,20.75
  Bottom 0.254: v59,25.75 59,25 59.5,24.5 59.5,20.75 v74.25,20.75
PROM_INITB  (via drill 0.6, 0.7)
  Top 0.254: U1.P58 54.97,24.28 54.5,24.75 v54,24.75 | v78.75,16.25 78.5,16.5 76.98,16.5 IC1.8
  Bottom 0.254: v54,24.75 54,20 71.75,20 75.25,16.5 78.5,16.5 v78.75,16.25
PS2CLK  (via drill 0.6)
  Top 0.254: U1.P46 48.97,21.97 47.75,20.75 42.25,20.75 41.5,20 34,20 v33,19 | v29.25,19 29.75,18.5 | 29.75,18.5 27.7,18.5 R47.2 | 29.75,18.5 29.75,17.3 R4.1 T1.2
  Bottom 0.254: v33,19 v29.25,19
PS2DAT  (via drill 0.6)
  Top 0.254: U1.P44 48,23.02 48,22 47.25,21.25 41.75,21.25 41,20.5 32.5,20.5 v32.25,20.25 | R6.1 T3.2 21.29,18.5 19.25,18.5 | R6.1 | v19.25,20.25 19.25,18.5 | 19.25,18.5 R51.2 | R6.1 20.99,20.24
  Bottom 0.254: v32.25,20.25 v19.25,20.25
R0
  Top 0.254: U1.P55 53.47,20.47 50.2,17.2 R10.1
R1
  Top 0.254: U1.P53 52.47,20.47 50.25,18.25 46.75,18.25 46,17.5 R9.1
SCART_BLANKING  (via drill 0.6)
  Top 0.254: v54.5,10.5 54.5,7.5 51.25,4.25 50.98,4.25 X1.16
  Bottom 0.254: v54.5,10.5 53,12 52,12 51.5,12.5 51.5,18 51,18.5 42.5,18.5 41.5,17.5 40.95,17.5 R50.1
SCART_BLUE
  Bottom 0.254: R33.1 R32.1 R31.1 67.87,9.58 X1.7
SCART_COMP
  Bottom 0.254: R14.1 R13.1 45.01,11.69 X1.19
SCART_GREEN
  Bottom 0.254: R27.1 R28.1 R26.1 60.25,12.2 X1.11
SCART_LEFT  (via drill 0.7)
  Top 0.2: C3.2 v71.4,12.9
  Bottom 0.2: v71.4,12.9 73.1,12.9 75.5,10.5
  Bottom 0.254: X1.3 75.49,10.49 75.5,10.5
SCART_RED
  Bottom 0.254: R16.1 R20.1 R15.1 50,12.2 50,11.75 52.63,9.12 X1.15
SCART_RIGHT  (via drill 0.6)
  Top 0.254: C4.2 v82.75,13.5
  Bottom 0.254: v82.75,13.5 79.5,13.5 79.3,13.3 X1.1
SD_CLK  (via drill 0.6)
  Top 0.254: U1.P41 46.5,23.05 46.5,25 v45.5,26
  Bottom 0.254: v45.5,26 45,26 44.5,25.5 38.5,25.5 33.25,30.75 31.5,30.75 30.5,31.75 U$3.5
SD_CS  (via drill 0.6)
  Top 0.254: v26.5,46 30,46 31.5,47.5 42.25,47.5 43.5,46.25 43.75,46 45.5,46 45.97,45.53 U1.P141
  Bottom 0.254: U$3.1 29.69,42 27,42 26.5,42.5 v26.5,46
SD_DI  (via drill 0.6)
  Top 0.254: v25,47 29.5,47 30.5,48 42.75,48 44,46.75 44.25,46.5 46,46.5 46.47,46.03 U1.P140
  Bottom 0.254: U$3.2 29.69,39.5 25.5,39.5 25,40 v25,47
SD_DO  (via drill 0.6)
  Top 0.254: U1.P40 45.97,24.22 45.75,24.5 v45.25,24.75
  Bottom 0.254: v45.25,24.75 37.5,24.75 35.5,26.75 29.94,26.75 U$3.7
SPI_MISO
  Top 0.254: IC3.17 81.76,35.24 82,35 84.5,35 85.5,34 85.5,31 87.5,29 87.5,26 88.5,25 90.5,25 91.77,23.73 SV1.16
SPI_MOSI
  Top 0.254: IC3.16 80.47,34.53 81,34 83.5,34 84.5,33 84.5,30 86.5,28 86.5,25 87.5,24 87.5,22.5 88,22 88,20.5 88.5,20 90.5,20 91.77,18.73 SV1.20
SPI_SCLK
  Top 0.254: IC3.15 79.47,35.47 79.75,35.75 80.5,35.75 81.75,34.5 84,34.5 85,33.5 85,30.5 87,28.5 87,25.5 88,24.5 88,23 88.5,22.5 90.5,22.5 91.77,21.23 SV1.18
SPI_SEL  (via drill 0.6)
  Top 0.254: v83.5,36 84,36 84.5,35.5 85,35.5 86,34.5 86,31.5 88,29.5 88,28 88.5,27.5 90.5,27.5 91.77,26.23 SV1.14 | IC3.14 78.67,36.17 v78.75,36.25
  Bottom 0.254: v83.5,36 83.5,35.75 79.25,35.75 v78.75,36.25
TCK  (via drill 0.6, 0.7)
  Top 0.254: R2.2 62.25,50 v62.25,51.25 | IC3.19 84.87,37.62 v85,37.5 87,35.5 87,32.5 88.19,31.31 89.19,31.31 SV1.9 | IC1.6 78.84,17.84 80,19 v80,20.5
  Bottom 0.254: v62.25,51.25 62.25,47.75 63,47 64,47 65,46 70.5,46 71.5,45 82.5,45 83,44.5 83,39.5 v85,37.5 85,35.5 84.5,35 80.5,35 79,33.5 79,25 80,24 v80,20.5
TDI_FPGA  (via drill 0.6, 0.7)
  Top 0.254: 39,46.25 R1.2 37.5,46.25 v37.25,46.5 | SV1.7 89.25,33.79 89.25,33.75 88,35 88,37.5 86.28,39.22 IC3.21 81.73,39.25 79,39.25 v78.75,39
  Bottom 0.254: v37.25,46.5 38.25,45.5 43.5,45.5 44,45 62,45 63,44 68.5,44 70.5,42 77,42 77.5,41.5 77.5,39.5 78,39 v78.75,39
TDO_EXP
  Top 0.254: IC3.23 85.68,40.82 88.75,37.75 90,37.75 90.5,37.25 90.5,35.17 91.77,33.9 SV1.8
TDO_FPGA  (via drill 0.6)
  Top 0.254: U1.P109 61.97,43.47 v61.25,42.75 | IC1.4 75.14,19.14 v74.75,19
  Bottom 0.254: v61.25,42.75 66.5,42.75 66.5,31.75 69.75,31.75 75.25,26.25 75.25,19.25 v74.75,19
TDO_PROM  (via drill 0.6, 0.7)
  Top 0.254: IC1.17 82.36,19.14 81.5,20 v81.5,20.5 | IC3.20 85.58,38.42 v86.25,37.75 87.5,36.5 87.5,33 88,32.5 90.5,32.5 91.73,31.27 SV1.10
  Bottom 0.254: v86.25,37.75 86.25,35.75 85,34.5 81,34.5 79.5,33 79.5,25.5 81.5,23.5 v81.5,20.5
TMS  (via drill 0.6, 0.7)
  Top 0.254: R3.2 v60.75,52 | v80.25,36.75 80.68,36.82 IC3.18 84.18,36.82 85,36 85.5,36 86.5,35 86.5,32 88.5,30 90.5,30 SV1.12 | v78.75,20.5 78.75,19.25 78,18.5 76.96,18.5 IC1.5
  Bottom 0.254: v60.75,52 60.75,47.75 62,46.5 63.5,46.5 64.5,45.5 70,45.5 71,44.5 82,44.5 82.5,44 82.5,40.5 79.5,37.5 | v78.75,20.5 78.75,24.25 78.5,24.5 78.5,34.5 77.5,35.5 77.5,37 78,37.5 79.5,37.5 | 79.5,37.5 v80.25,36.75
VCC  (via drill 0.6, 0.7)
  Top 0.2: U$6.P8 36.25,44.5 36,44.75 | v36.25,45.25 36.25,44.75 | 81,51 81,51.25 R11.1
  Top 0.254: T2.3 13.25,47.25 13,47 | T3.3 23.24,20.21 R6.2 | T1.3 31.74,17.21 R4.2 | Q5.3 43,11.75 | Q6.3 48.75,12 48.5,11.75 | U$2.VDD 52.52,11.78 52.5,11.75 | Q8.3 58.25,12 58,11.75 | Q7.3 64,11.75 | U1.P3 v44,41.5 v47.25,41.5 47.47,41.72 U1.P138 | U1.P126 53.47,41.78 v53.5,41.75 | U1.P115 58.97,41.53 v59,41.5 61,39.75 | v62,41.5 62.5,41.5 U1.P106 | U1.P91 v62.25,34 61,34 | U1.P75 62.5,26 62.25,25.25 | U1.P66 58.97,23.97 60,25 60,25.75 v60.25,26 60.75,26.5 61,26.5 | U1.P54 52.97,24.53 v52.75,24.75 | U1.P43 v47.47,24.53 47.47,27.47 v47.5,27.5 | U1.P34 44,26 | IC3.31 75.47,44.76 75.36,44.86 | IC3.4 74.72,39.22 75.5,40 75.5,43.09 IC3.31 | IC3.31 IC3.32 | v52,37.25 53,38.5 53,41.25 v53.5,41.75 | v47.75,37.5 45.25,37.5 45,39 | 53.25,41.5 v53.5,41.75 | U1.P19 v44,33.5 45.25,33.5 | v25,31 25,25 22.75,22.75 | IC2.8 76.32,29.18 | 76.32,29.18 v75,30.5 | 76.32,29.18 76.32,30.82 76.5,31 80.5,31 81.5,30 81.5,22 | IC1.18 IC1.19 IC1.20 83.39,21.89 83.5,22 | C26.1 82.9,22.1 83,22
  Top 0.6: 93.25,38.75 93.11,38.89 SV1.4 SV1.3
  Top 0.7: 45.25,33.5 45.25,37.5 45.25,40.25 v44,41.5 44,43 42.25,44.75 36.25,44.75 36,44.75 24.75,44.75 21.5,48 19.5,48 18.5,49 | 45.25,27.5 v44,26.5 44,26 44,24.5 43.5,24 43,24 40.5,21.5 31.5,21.5 30.5,20.5 | v62,27 61,27 | 61,27 61,33.5 | 61,33.5 61,34 61,39.75 61,40 62.5,41.5 62.5,43 63,43.5 63,45.5 64,46.5 64,52.8 R37.2 R38.2 | 61,27 61,26.5 62.25,25.25 62.25,24.75 63.52,23.48 SV2.6 69.98,23.48 70,23.5 | 79.25,51.25 81,51.25 84.25,51.25 84.75,50.75 84.75,48.75 87.8,45.7 R55.1 R56.1 92.05,45.7 93.25,44.5 93.25,38.75 93.25,17.25 92,16 88.5,16 85.5,19 85.5,20 83.5,22 83,22 81.5,22 72,22 70.5,23.5 70.48,23.48 SV2.4 | 45.25,27.5 v47.5,27.5 | 45.25,33.5 45.25,27.5 | 45.25,33.5 v56.75,33.5 | v59.25,33.5 61,33.5
  Top 0.813: R42.1 R45.1 R41.1 R44.1 R40.1 20.05,53.55 19,52.5 19,49.5 18.5,49 17.8,48.3 R22.1 15.3,48.3 14,47 13,47 10,47 9.5,46.5 9.5,29 10.75,27.75 REG3.3.4 14.25,27.75 18.65,23.35 C39.+ 22.15,23.35 22.75,22.75 23.2,22.3 R6.2 30.25,20.25 31.7,18.8 R4.2 32.75,17.25 33,17 33,12 34.29,10.71 SV5.7 SV5.8 38.71,10.71 39.75,11.75 43,11.75 48.5,11.75 52.5,11.75 58,11.75 64,11.75 84.25,11.75 88.5,16 | R42.1 R43.1 R46.2 R36.2 R39.2 R35.2 R38.2 | SV3.1 30.57,53.37 R42.1 | R37.2 65.55,53.55 66.25,54.25 66.25,55.75 v67,56.5 | C27.1 75.36,44.86 79.25,48.75 79.25,51.25 v79.25,53.5
  Bottom 0.2: C34.1 36.5,45 v36.25,45.25
  Bottom 0.25: v47.25,41.5 46.25,41.5 46,41.75
  Bottom 0.254: 42.5,41.5 C9.1 v44,41.5 45.65,41.5 C12.1 45.75,41.5 46,41.75 | v53.5,41.75 53.75,41.5 C6.1 | C7.1 59.15,41.35 v59,41.5 | v62,41.5 C13.1 | v62.25,34 C10.1 | C8.1 60,26 v60.25,26 | v52.75,24.75 52.75,25.85 C15.1 51.35,27.5 v47.5,27.5 | v47.47,24.53 47.47,22.47 46.85,21.85 C14.1 | v44,26.5 42.85,26.5 C16.1 | v52,37.25 48,37.25 v47.75,37.5 | C11.1 v44,33.5 | U$3.4 25.45,34.45 25,34 v25,31 | v75,30.5 77,30.5 C29.1
  Bottom 0.7: C17.1 v62,27 | v56.75,33.5 v59.25,33.5
  Bottom 0.813: v67,56.5 77.5,56.5 79.25,54.75 v79.25,53.5
VCC5  (via drill 0.6)
  Top 0.813: X7.2 3.15,13.35 2,14.5 2,19.4 C33.+ 2.1,25.5 | 2.1,25.5 2.1,33.5 | 2.1,33.5 2.1,40.1 2.94,40.94 REG2.5.3 | REG1.2.3 2.41,33.19 2.1,33.5 | 2.1,25.5 2.16,25.44 REG3.3.3 9.84,22 15.5,22 17.5,20 17.5,14.5 v17.95,14.05 R7.2 R5.2 26.5,13.8 26.5,9.5 27.77,8.23 PWR_HDR.2 29.06,8.17 SV5.9 SV5.10
  Bottom 0.813: v17.95,14.05 17.95,11.35 X3.5
VCCAUX  (via drill 0.6)
  Top 0.254: 50,24.75 v49.5,24.75 | U1.P62 57,22.58 v57,26 57,28.75 56.62,29.12 | U1.P48 50,22.58 50,24.75 | 50,24.75 50,26.75 52.5,29.25 56.5,29.25 56.62,29.12 | U1.P134 49.47,42.78 v49.75,42.25 49.75,37.75 47.75,35.75 | U1.P120 56.47,43.03 | 57,42.5 56.47,42.97 56.47,43.03 | 56.47,43.03 v56.75,42.75 | 56.5,29.5 56.62,29.38 56.62,29.12 | 56.75,35.25 57,35
  Top 0.7: 56.75,35.25 v56.75,42.75 | 58,35 58,30.75 56.62,29.38
  Top 0.813: REG2.5.4 15.25,43.25 18.15,40.35 C40.+ 25.65,40.35 31.5,34.5 v33,34.5 | v46.5,36.25 47.25,36.25 47.75,35.75 48.5,35 57,35 58,35
  Bottom 0.254: v49.5,24.75 C21.1 49.5,23 49,23 48,22 48,20 47.5,19.5 41,19.5 | v57,26 57,23.5 58,23 58.1,23.1 C18.1 | v56.75,42.75 56.75,42.5 58,41.25 58,40.5 58.25,40.25 C20.1 | v49.75,42.25 49.75,40.75 49.5,40.5 49.4,40.6 C19.1 | 41,19.5 40,19.5 | 40,19.5 38.5,19.5 37.5,18.5 37.52,18.48 SV5.2 | 40.3,19.45 40,19.5 | R50.2 40.75,19.75 41,19.5
  Bottom 0.813: v33,34.5 33.5,34.5 35.25,36.25 v46.5,36.25
VCCINT  (via drill 0.5, 0.6)
  Top 0.254: U1.P61 56.5,22.58 56.5,24.25 v56,24.75 | U1.P49 50.5,22.58 50.5,24.75 | 50.5,24.75 v51.5,24.75 | U1.P133 49.97,43.53 50.75,42.75 v51,42.75 | v55.5,42.75 56,43.5 56,44.5 55.97,44.47 U1.P121 | 50.5,24.75 51.5,25.75 55.5,25.75
  Top 0.406: v33.5,22.75 31.25,22.75 31,23 31,32.75
  Top 0.7: v56,24.75 55.5,25.25 55.5,25.75 55.5,28 v55,28 | v55.5,37 v55.5,42.75
  Top 0.813: REG1.2.4 15,35.5 18.65,31.85 C42.+ 20.4,32.75 31,32.75 33,32.75 v33,32.5
  Bottom 0.254: C22.1 51.5,42.5 v51,42.75 v55.5,42.75 55.5,41.5 56,41 C23.1 | SV5.1 34.98,20.02 33.5,21.5 v33.5,22.75 | v56,24.75 C25.1 | C24.1 51.75,24.75 v51.5,24.75
  Bottom 0.813: 55,30.75 55,37 v55.5,37 | 55,30.75 34.75,30.75 v33,32.5 | v55,28 55,30.75
X3
  Top 0.254: U1.P76 66.98,26.5 SV2.5
X4
  Top 0.254: U1.P77 66.5,27 67,27.5 68.5,27.5 70,26 SV2.3
X8  (via drill 0.6)
  Top 0.254: U1.P74 v65.5,25.5
  Bottom 0.254: v65.5,25.5 66.25,24.75 71.27,24.75 SV2.1

## Text on the board
Bottom: CPCFPGA.COM rev 1 (c) 2012 Ranulf Doswell
tSilk: 2012-04-02 | CPCFPGA.COM | CPC2012 prototype | CPC2012 prototype rev 1 | (c) 2012 Ranulf Doswell | VCC GND P137 P135 P132 P130 P129 P128 P127 P123 | -FPGA-XTAL- | 2.5V | HWB | 1.2V | CPCFPGA.COM | P76 | P76 | P77 | P77 | P74 | 3.3V | laborare est aemulari | VCCINT | VCC | VCC | GND | VCCAUX | P83 P84 P85 P86 P87 TCK TDI GND VCC | MOSI SCLK MISO SEL TMS TDO TDO2 GND VCC RST | GND | P47 | #crtc | VCC | P50 | P51 | GND | VCC | 5V | 5V | 5V
_tsilk: 5V 0V
_bsilk: CPCFPGA.COM rev 1 (c) 2012 Ranulf Doswell | CAS IN | Joystick 0 | Joystick 1 | USB | CPC2012 prototype rev 1 | 2012-04-03 #29 | (c) 2012 Ranulf Doswell | VCC GND P137 P135 P132 P130 P129 P128 P127 P123 | -FPGA-XTAL- | laborare est aemulari | HWB | SDCARD | P77 | P76 | P74 | VCC | VCC | GND | VCCINT | VCCAUX | P83 P84 P85 P86 P87 TCK TDI GND VCC | MOSI SCLK MISO SEL TMS TDO TDO2 GND VCC RST | GND | P47 | GND | P50 | VCC | P51 | VCC | 5V | 5V | 5V | 5V | PS/2 keyboard | SCART